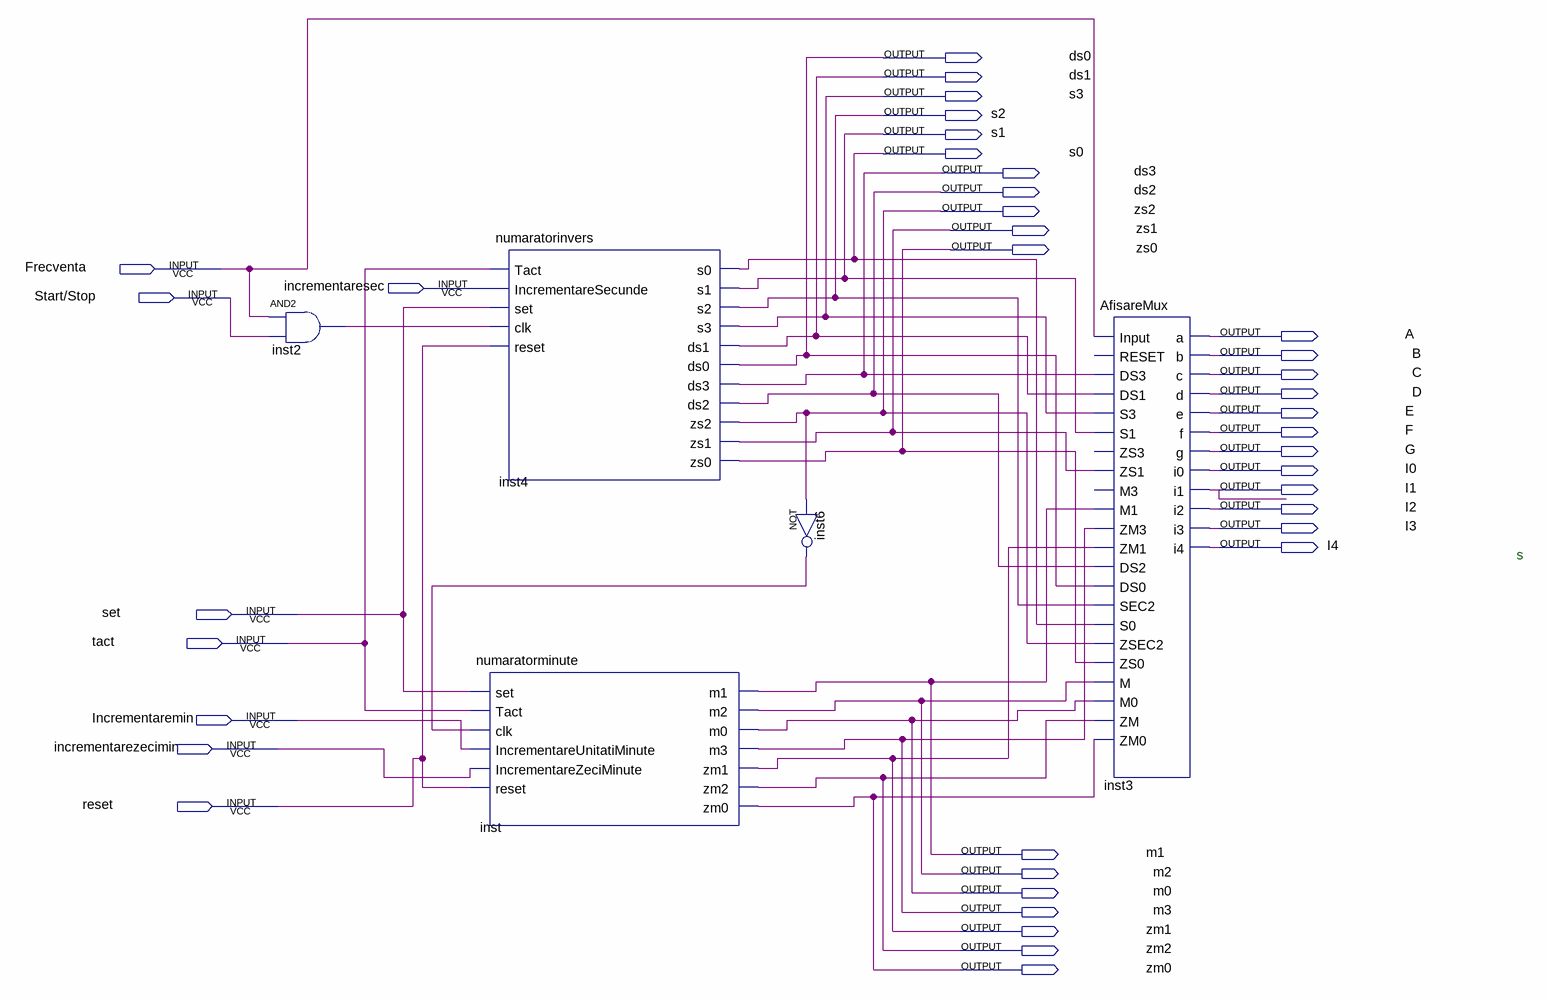
[diagram p0: schematic sheet]
// Quartus schematic CRONOMETRUINVERS.bdf as structural Verilog: 5 symbols, 38 pins
module CRONOMETRUINVERS (
  input  Frecventa,
  input  incrementaresec,
  input  \Start/Stop ,
  input  set,
  input  tact,
  input  Incrementaremin,
  input  incrementarezecimin,
  input  reset,
  output ds0,
  output ds1,
  output s3,
  output s2,
  output s1,
  output s0,
  output ds3,
  output ds2,
  output zs2,
  output zs1,
  output zs0,
  output A,
  output B,
  output C,
  output D,
  output E,
  output F,
  output G,
  output I0,
  output I1,
  output I2,
  output I3,
  output I4,
  output m1,
  output m2,
  output m0,
  output m3,
  output zm1,
  output zm2,
  output zm0
);

  wire inst2_out, inst6_out;

  and inst2 (inst2_out, Frecventa, \Start/Stop );
  numaratorinvers inst4 (
    .Tact(tact), .IncrementareSecunde(incrementaresec), .set(set), .clk(inst2_out), .reset(reset), .s0(s0),
    .s1(s1), .s2(s2), .s3(s3), .ds1(ds1), .ds0(ds0), .ds3(ds3), .ds2(ds2), .zs2(zs2), .zs1(zs1), .zs0(zs0));
  numaratorminute inst (
    .set(set), .Tact(tact), .clk(inst6_out), .IncrementareUnitatiMinute(Incrementaremin),
    .IncrementareZeciMinute(incrementarezecimin), .reset(reset), .m1(m1), .m2(m2), .m0(m0), .m3(m3),
    .zm1(zm1), .zm2(zm2), .zm0(zm0));
  not inst6 (inst6_out, zs2);
  AfisareMux inst3 (
    .Input(Frecventa), .DS3(ds3), .DS1(ds1), .S3(s3), .S1(s1), .ZS1(zs1), .M1(m1), .ZM3(m3), .ZM1(zm1),
    .DS2(ds2), .DS0(ds0), .SEC2(s2), .S0(s0), .ZSEC2(zs2), .ZS0(zs0), .M(m2), .M0(m0), .ZM(zm2), .ZM0(zm0),
    .a(A), .b(B), .c(C), .d(D), .e(E), .f(F), .g(G), .i0(I0), .i1(I1), .i2(I2), .i3(I3), .i4(I4));  // open: RESET, ZS3, M3

  // Notes on the sheet:
  //   s
endmodule
